# Altium project Switchberry.PrjPcb
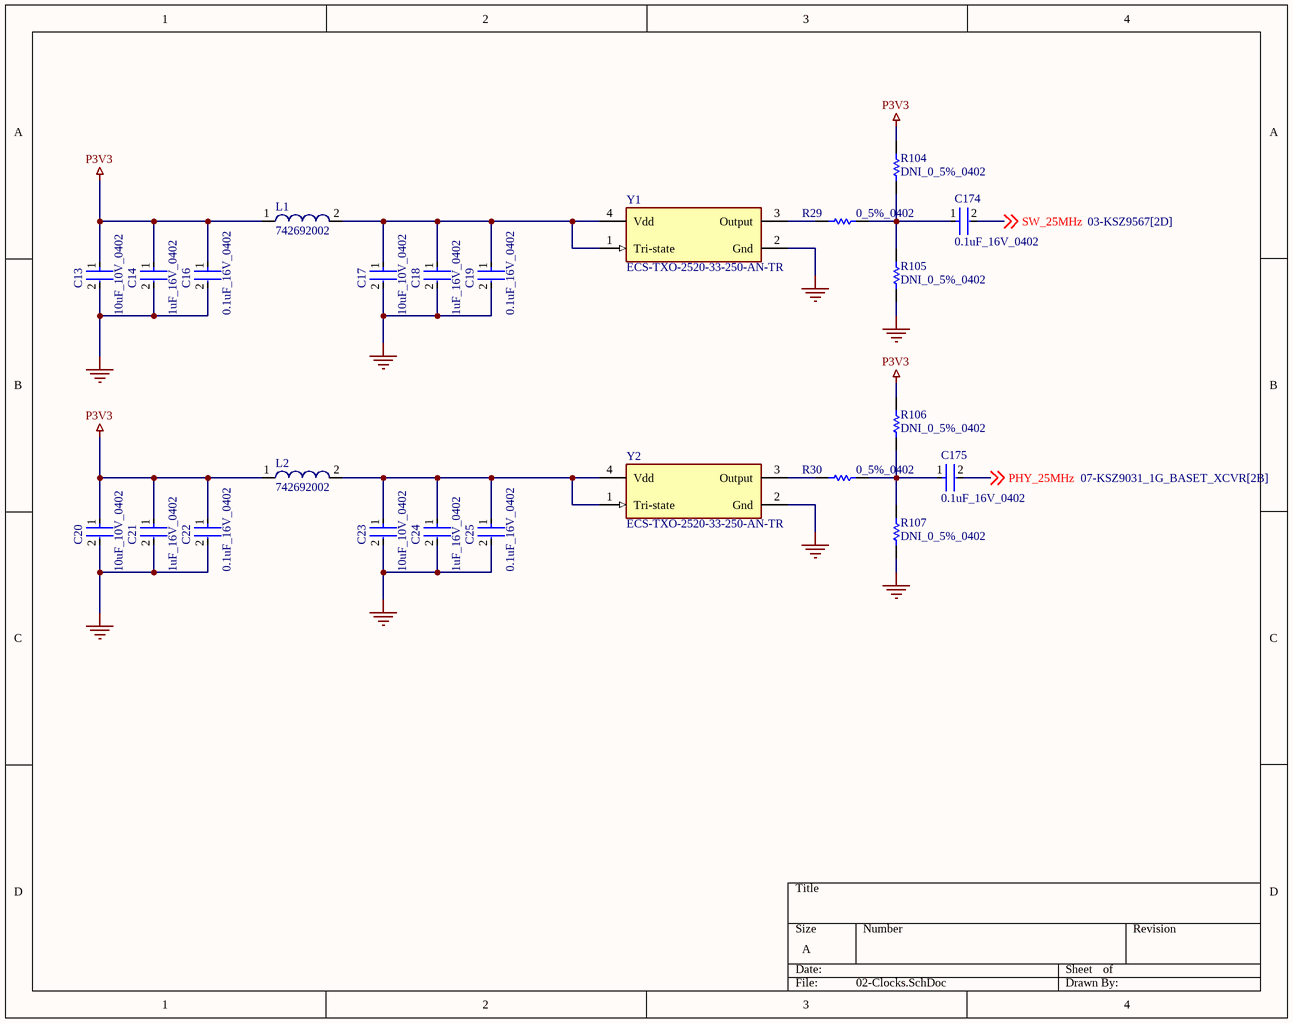
[diagram p0: 02-Clocks.SchDoc]
2 sheets, 96 parts. Net scope: global (net labels, ports and power ports of the same name join across sheets).
Board file: Switchberry.PcbDoc
Sheets:
  02-Clocks.SchDoc
  07-KSZ9031_1G_BASET_XCVR.SchDoc

## Sheet 02-Clocks.SchDoc
size A; SheetNumber: 2; SheetTotal: 11

### Parts
C13  10uF_10V_0402  [FP-CL05A106MP5NUNC-MFG]
C14  1uF_16V_0402  [FP-0402-L_1_0_0_05-W_0_5-IPC_A]
C16  0.1uF_16V_0402  [FP-C0402-BB-MFG]
C17  10uF_10V_0402  [FP-CL05A106MP5NUNC-MFG]
C18  1uF_16V_0402  [FP-0402-L_1_0_0_05-W_0_5-IPC_A]
C19  0.1uF_16V_0402  [FP-C0402-BB-MFG]
C20  10uF_10V_0402  [FP-CL05A106MP5NUNC-MFG]
C21  1uF_16V_0402  [FP-0402-L_1_0_0_05-W_0_5-IPC_A]
C22  0.1uF_16V_0402  [FP-C0402-BB-MFG]
C23  10uF_10V_0402  [FP-CL05A106MP5NUNC-MFG]
C24  1uF_16V_0402  [FP-0402-L_1_0_0_05-W_0_5-IPC_A]
C25  0.1uF_16V_0402  [FP-C0402-BB-MFG]
C174  0.1uF_16V_0402  [FP-C0402-BB-MFG]
C175  0.1uF_16V_0402  [FP-C0402-BB-MFG]
L1  742692002  [WE-TMSB 0201]
L2  742692002  [WE-TMSB 0201]
R29  0_5%_0402  [RESC1005X40X25NL05T10]
R30  0_5%_0402  [RESC1005X40X25NL05T10]
R104  DNI_0_5%_0402  [RESC1005X40X25NL05T10]  (no BOM)
R105  DNI_0_5%_0402  [RESC1005X40X25NL05T10]  (no BOM)
R106  DNI_0_5%_0402  [RESC1005X40X25NL05T10]  (no BOM)
R107  DNI_0_5%_0402  [RESC1005X40X25NL05T10]  (no BOM)
Y1  ECS-TXO-2520-33-250-AN-TR  [FP-ECS-TXO-2520-MFG]
Y2  ECS-TXO-2520-33-250-AN-TR  [FP-ECS-TXO-2520-MFG]

### Nets
GND: C13.2 C14.2 C16.2 C17.2 C18.2 C19.2 C20.2 C21.2 C22.2 C23.2 C24.2 C25.2 R105.1 R107.1 Y1.2(Gnd) Y2.2(Gnd)
P3V3: C13.1 C14.1 C16.1 C20.1 C21.1 C22.1 L1.1 L2.1 R104.2 R106.2
PHY_25MHz: C175.2 ; off-sheet PHY_25MHz
SW_25MHz: C174.2 ; off-sheet SW_25MHz
NetC17_1: C17.1 C18.1 C19.1 L1.2 Y1.1(Tri-state) Y1.4(Vdd)
NetC23_1: C23.1 C24.1 C25.1 L2.2 Y2.1(Tri-state) Y2.4(Vdd)
NetC174_1: C174.1 R29.2 R104.1 R105.2
NetC175_1: C175.1 R30.2 R106.1 R107.2
NetR29_1: R29.1 Y1.3(Output)
NetR30_1: R30.1 Y2.3(Output)

### Library data of the parts
C13 C17 C20 C23 = CMP-13271-000002-1: CAP CER 10UF 10V X5R 0402; Manufacturer Part Number: CL05A106MP5NUNC; Manufacturer: Samsung; Temperature Coefficient: 15%; Tolerance: 20%; Material: Ceramic; Octopart: https://octopart.com/cl05a106mp5nunc-samsung-22457395; Voltage Rating: 10V; RoHS: TRUE; Value: 10uF; Height: 0.7mm; Digikey Description: CAP CER 10UF 10V X5R 0402; Automotive: No; Package: CL05A106MP5NUNC; Device Class L1: Passive Components; Capacitance: 10uF; Temperature Range High: +85°C; ComponentLink2Description: Datasheet; Device Class L2: Capacitors; Temperature Characteristic: X5R; Temperature: -55°C to +85°C; ComponentLink2URL: http://www.samsungsem.com/kr/support/product-search/mlcc/__icsFiles/afieldfile/2019/05/10/19-CL05A106MP5NUNC.pdf; Device Class L3: Ceramic Capacitors; Category: Cap; Temperature Range Low: -55°C; Ipc Land Pattern Name: CAPC10050X50; Lead Free: Yes
C14 C18 C21 C24 = CMP-14477-000104-2: None; Tolerance: 10%; Voltage Rating: 16V; Dielectric: X5R; Capacitance: 1uF; Packaging: Tape and Reel; Depth: 0.5mm; Mount: Surface Mount; Thickness: 0.022inch; Package Quantity: 1; Min Operating Temperature: -55°C; Series: M; Voltage Rating (DC): 16V; Termination: SMD/SMT; Case/Package: 0402; Number of Pins: 2; Case Code (Imperial): 0402; Length: 1mm; Halogen Free: Halogen Free; Case Code (Metric): 1005; Width: 0.02inch; RoHS Compliant: Yes; Radiation Hardening: No; Max Operating Temperature: 85°C; Height: 0.5mm; Construction: Flat
C16 C19 C22 C25 C174 C175 = CMP-1034-02068-3: CAP CER 0.1UF 16V 5% X7R 0402; Manufacturer: Kemet; Manufacturer Part Number: C0402C104J4RACTU; Value: 0.10 μF; Temperature Coefficient: 15%; Tolerance: 0.05; Material: Ceramic; ComponentLink2URL: https://content.kemet.com/datasheets/KEM_C1002_X7R_SMD.pdf; Automotive: No; Device Class L2: Capacitors; Temperature: -55°C to +125°C; RoHS: TRUE; Voltage Rating: 16 V; ComponentLink2Description: Datasheet; Device Class L3: Ceramic Capacitors; Temperature Range Low: -55°C; Ipc Land Pattern Name: CAPC10050X50; Device Class L1: Passive Components; Temperature Range High: +125°C; Package: C0402-BB; Capacitance: 0.10 μF; Category: Cap; Mouser Description: CAP CER 0.1UF 16V X7R 0402; Height: 0.55mm; Digikey Description: CAP CER 0.1UF 16V 5% X7R 0402; Octopart: https://octopart.com/c0402c104j4ractu-kemet-12573893; Temperature Characteristic: X7R; Lead Free: Yes
L1 L2 = CMP-1490-00001-1: Tiny Multilayer Suppression  Bead  WE-TMSB, Z= 60 Ohm; Manufacturer: Wuerth Elektronik; Impedance: 60 Ohm; PartNumber: 742692002; PackageReference: WE-TMSB 0201; ComponentLink1Description: Manufacturer URL; ComponentLink2URL: http://www.we-online.de/katalog/media/pdf/742692002.pdf; ComponentLink1URL: http://www.we-online.com; ComponentLink2Description: Datasheet
R29 R30 R104-R107 = CMP-2002-06457-1: Manufacturer: Panasonic; Part Number: ERJ-U020R00X
Y1 Y2 = CMP-40224-000034-1: XTAL OSC TCXO 25.0000MHZ HCMOS; RoHS Compliant: Yes

## Sheet 07-KSZ9031_1G_BASET_XCVR.SchDoc
size B; SheetNumber: 7; SheetTotal: 11
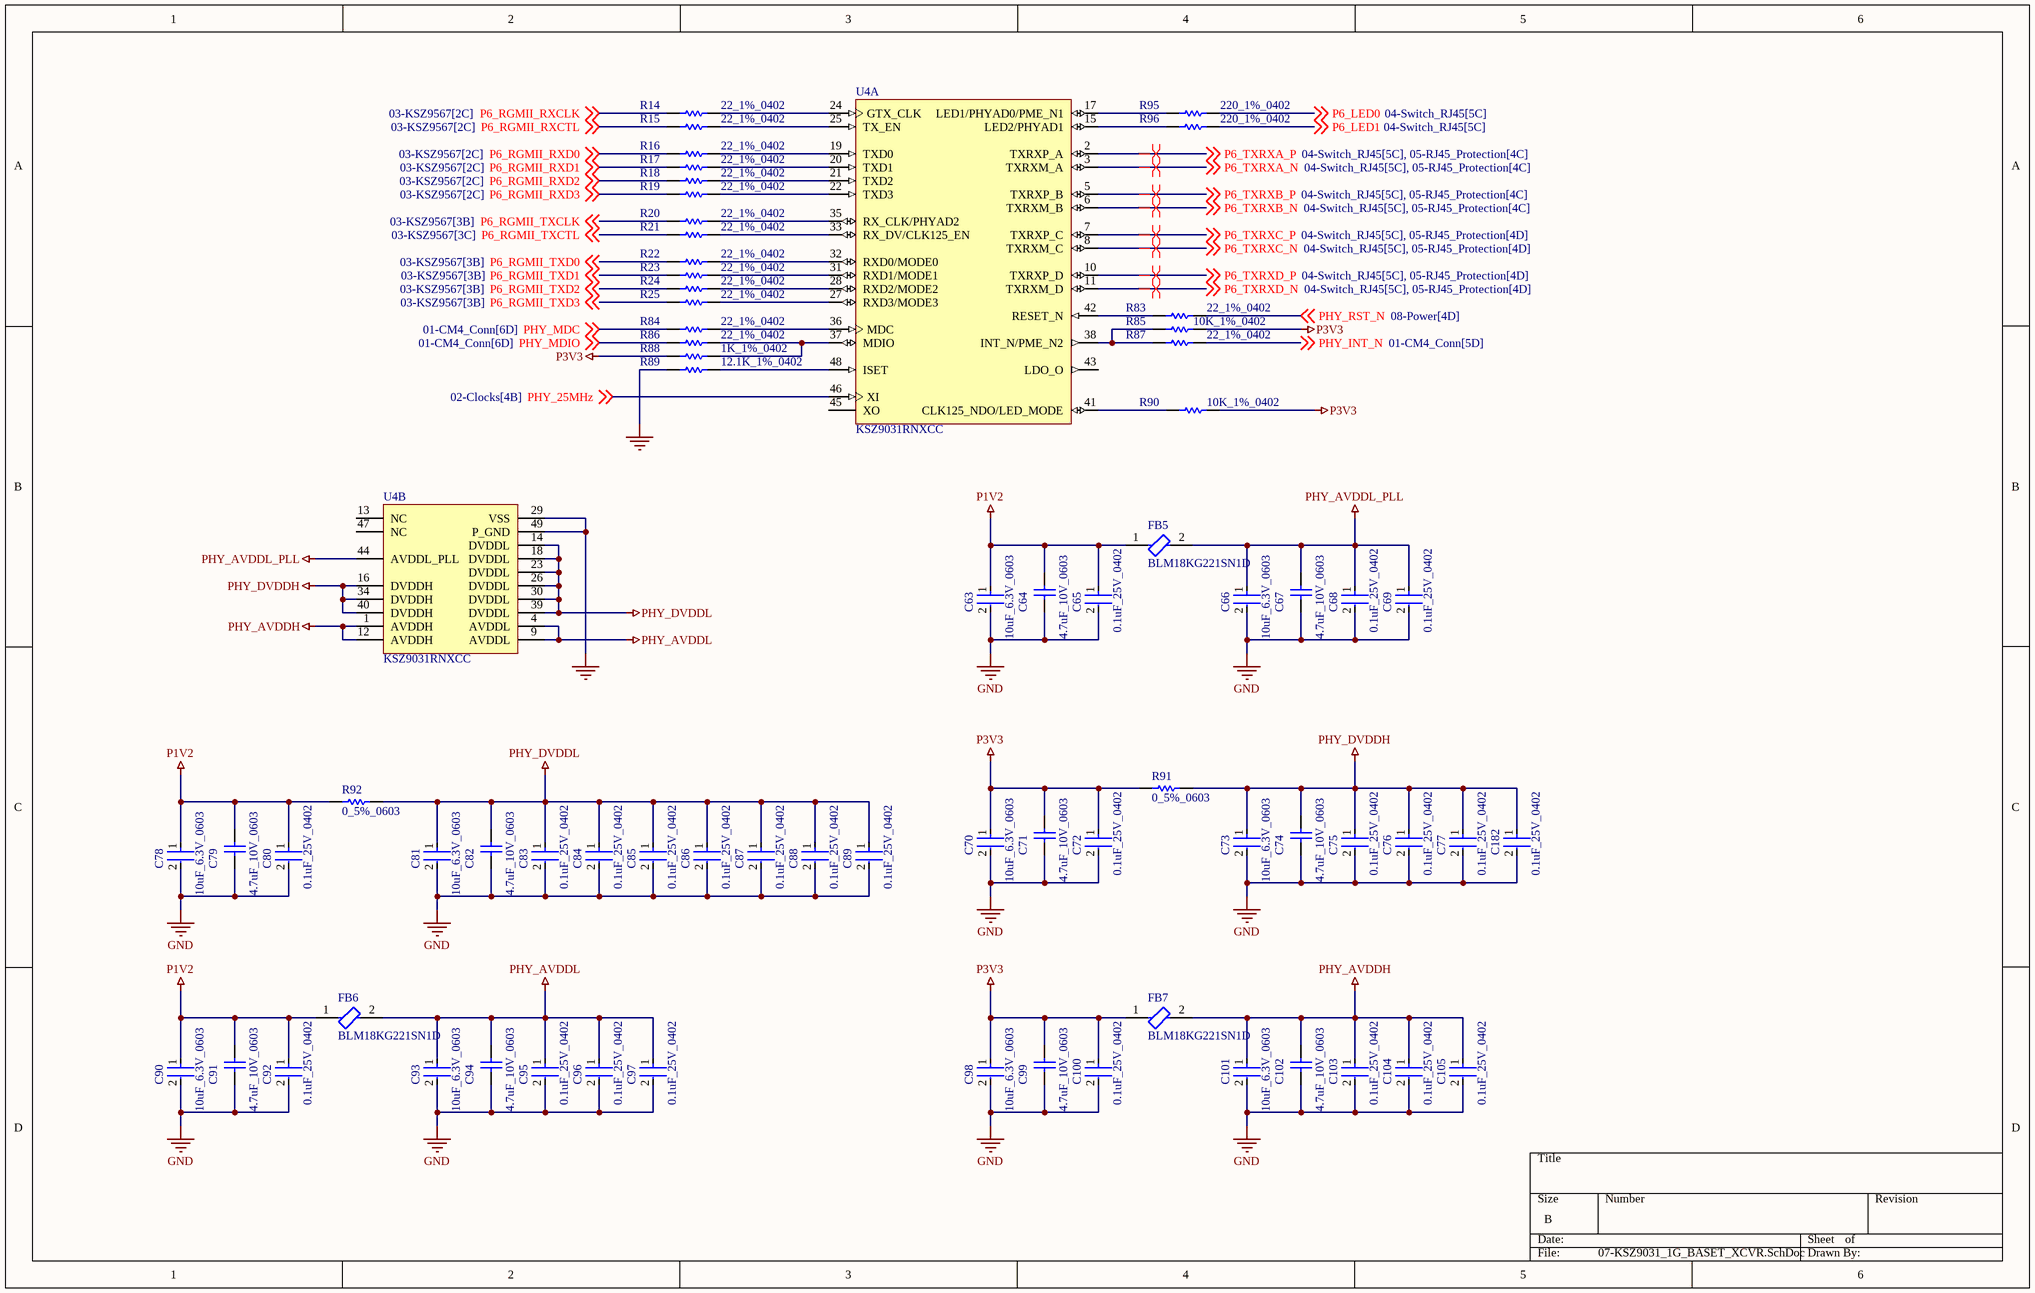
[diagram p1: 07-KSZ9031_1G_BASET_XCVR.SchDoc]

### Parts
C63  10uF_6.3V_0603  [FP-C0603C106M9PACTU-MFG]
C64  4.7uF_10V_0603  [CAPC1608X87X35NL15T15]
C65  0.1uF_25V_0402  [FP-0402-L_1_0_1-W_0_5_0_1-IPC_C]
C66  10uF_6.3V_0603  [FP-C0603C106M9PACTU-MFG]
C67  4.7uF_10V_0603  [CAPC1608X87X35NL15T15]
C68  0.1uF_25V_0402  [FP-0402-L_1_0_1-W_0_5_0_1-IPC_C]
C69  0.1uF_25V_0402  [FP-0402-L_1_0_1-W_0_5_0_1-IPC_C]
C70  10uF_6.3V_0603  [FP-C0603C106M9PACTU-MFG]
C71  4.7uF_10V_0603  [CAPC1608X87X35NL15T15]
C72  0.1uF_25V_0402  [FP-0402-L_1_0_1-W_0_5_0_1-IPC_C]
C73  10uF_6.3V_0603  [FP-C0603C106M9PACTU-MFG]
C74  4.7uF_10V_0603  [CAPC1608X87X35NL15T15]
C75  0.1uF_25V_0402  [FP-0402-L_1_0_1-W_0_5_0_1-IPC_C]
C76  0.1uF_25V_0402  [FP-0402-L_1_0_1-W_0_5_0_1-IPC_C]
C77  0.1uF_25V_0402  [FP-0402-L_1_0_1-W_0_5_0_1-IPC_C]
C78  10uF_6.3V_0603  [FP-C0603C106M9PACTU-MFG]
C79  4.7uF_10V_0603  [CAPC1608X87X35NL15T15]
C80  0.1uF_25V_0402  [FP-0402-L_1_0_1-W_0_5_0_1-IPC_C]
C81  10uF_6.3V_0603  [FP-C0603C106M9PACTU-MFG]
C82  4.7uF_10V_0603  [CAPC1608X87X35NL15T15]
C83  0.1uF_25V_0402  [FP-0402-L_1_0_1-W_0_5_0_1-IPC_C]
C84  0.1uF_25V_0402  [FP-0402-L_1_0_1-W_0_5_0_1-IPC_C]
C85  0.1uF_25V_0402  [FP-0402-L_1_0_1-W_0_5_0_1-IPC_C]
C86  0.1uF_25V_0402  [FP-0402-L_1_0_1-W_0_5_0_1-IPC_C]
C87  0.1uF_25V_0402  [FP-0402-L_1_0_1-W_0_5_0_1-IPC_C]
C88  0.1uF_25V_0402  [FP-0402-L_1_0_1-W_0_5_0_1-IPC_C]
C89  0.1uF_25V_0402  [FP-0402-L_1_0_1-W_0_5_0_1-IPC_C]
C90  10uF_6.3V_0603  [FP-C0603C106M9PACTU-MFG]
C91  4.7uF_10V_0603  [CAPC1608X87X35NL15T15]
C92  0.1uF_25V_0402  [FP-0402-L_1_0_1-W_0_5_0_1-IPC_C]
C93  10uF_6.3V_0603  [FP-C0603C106M9PACTU-MFG]
C94  4.7uF_10V_0603  [CAPC1608X87X35NL15T15]
C95  0.1uF_25V_0402  [FP-0402-L_1_0_1-W_0_5_0_1-IPC_C]
C96  0.1uF_25V_0402  [FP-0402-L_1_0_1-W_0_5_0_1-IPC_C]
C97  0.1uF_25V_0402  [FP-0402-L_1_0_1-W_0_5_0_1-IPC_C]
C98  10uF_6.3V_0603  [FP-C0603C106M9PACTU-MFG]
C99  4.7uF_10V_0603  [CAPC1608X87X35NL15T15]
C100  0.1uF_25V_0402  [FP-0402-L_1_0_1-W_0_5_0_1-IPC_C]
C101  10uF_6.3V_0603  [FP-C0603C106M9PACTU-MFG]
C102  4.7uF_10V_0603  [CAPC1608X87X35NL15T15]
C103  0.1uF_25V_0402  [FP-0402-L_1_0_1-W_0_5_0_1-IPC_C]
C104  0.1uF_25V_0402  [FP-0402-L_1_0_1-W_0_5_0_1-IPC_C]
C105  0.1uF_25V_0402  [FP-0402-L_1_0_1-W_0_5_0_1-IPC_C]
C182  0.1uF_25V_0402  [FP-0402-L_1_0_1-W_0_5_0_1-IPC_C]
FB5  BLM18KG221SN1D  [FP-BLM18-0_15-t0_8-IPC_B]
FB6  BLM18KG221SN1D  [FP-BLM18-0_15-t0_8-IPC_B]
FB7  BLM18KG221SN1D  [FP-BLM18-0_15-t0_8-IPC_B]
R14  22_1%_0402  [RESC1005X40X25ML05T10]
R15  22_1%_0402  [RESC1005X40X25ML05T10]
R16  22_1%_0402  [RESC1005X40X25ML05T10]
R17  22_1%_0402  [RESC1005X40X25ML05T10]
R18  22_1%_0402  [RESC1005X40X25ML05T10]
R19  22_1%_0402  [RESC1005X40X25ML05T10]
R20  22_1%_0402  [RESC1005X40X25ML05T10]
R21  22_1%_0402  [RESC1005X40X25ML05T10]
R22  22_1%_0402  [RESC1005X40X25ML05T10]
R23  22_1%_0402  [RESC1005X40X25ML05T10]
R24  22_1%_0402  [RESC1005X40X25ML05T10]
R25  22_1%_0402  [RESC1005X40X25ML05T10]
R83  22_1%_0402  [RESC1005X40X25ML05T10]
R84  22_1%_0402  [RESC1005X40X25ML05T10]
R85  10K_1%_0402  [RESC1005X40X25NL10T10]
R86  22_1%_0402  [RESC1005X40X25ML05T10]
R87  22_1%_0402  [RESC1005X40X25ML05T10]
R88  1K_1%_0402  [RESC1005X40X25ML05T10]
R89  12.1K_1%_0402  [RESC1005X40X25NL10T10]
R90  10K_1%_0402  [RESC1005X40X25NL10T10]
R91  0_5%_0603  [RESC1608X55X25ML10T15]
R92  0_5%_0603  [RESC1608X55X25ML10T15]
R95  220_1%_0402  [RESC1005X40X25NL05T10]
R96  220_1%_0402  [RESC1005X40X25NL05T10]
U4  KSZ9031RNXCC  [MICL-QFN-48_V]  (parts A,B of 2)

### Nets
GND: C63.2 C64.1 C65.2 C66.2 C67.1 C68.2 C69.2 C70.2 C71.1 C72.2 C73.2 C74.1 C75.2 C76.2 C77.2 C78.2 C79.1 C80.2 C81.2 C82.1 C83.2 C84.2 C85.2 C86.2 C87.2 C88.2 C89.2 C90.2 C91.1 C92.2 C93.2 C94.1 C95.2 C96.2 C97.2 C98.2 C99.1 C100.2 C101.2 C102.1 C103.2 C104.2 C105.2 C182.2 R89.1 U4.29(VSS) U4.49(P_GND)
P1V2: C63.1 C64.2 C65.1 C78.1 C79.2 C80.1 C90.1 C91.2 C92.1 FB5.1 FB6.1 R92.1
P3V3: C70.1 C71.2 C72.1 C98.1 C99.2 C100.1 FB7.1 R85.2 R88.1 R90.2 R91.1
PHY_AVDDH: C101.1 C102.2 C103.1 C104.1 C105.1 FB7.2 U4.1(AVDDH) U4.12(AVDDH)
PHY_AVDDL: C93.1 C94.2 C95.1 C96.1 C97.1 FB6.2 U4.4(AVDDL) U4.9(AVDDL)
PHY_AVDDL_PLL: C66.1 C67.2 C68.1 C69.1 FB5.2 U4.44(AVDDL_PLL)
PHY_DVDDH: C73.1 C74.2 C75.1 C76.1 C77.1 C182.1 R91.2 U4.16(DVDDH) U4.34(DVDDH) U4.40(DVDDH)
PHY_DVDDL: C81.1 C82.2 C83.1 C84.1 C85.1 C86.1 C87.1 C88.1 C89.1 R92.2 U4.14(DVDDL) U4.18(DVDDL) U4.23(DVDDL) U4.26(DVDDL) U4.30(DVDDL) U4.39(DVDDL)
P6_LED0: R95.2 ; off-sheet P6_LED0
P6_LED1: R96.2 ; off-sheet P6_LED1
P6_RGMII_RXCLK: R14.1 ; off-sheet P6_RGMII_RXCLK
P6_RGMII_RXCTL: R15.1 ; off-sheet P6_RGMII_RXCTL
P6_RGMII_RXD0: R16.1 ; off-sheet P6_RGMII_RXD0
P6_RGMII_RXD1: R17.1 ; off-sheet P6_RGMII_RXD1
P6_RGMII_RXD2: R18.1 ; off-sheet P6_RGMII_RXD2
P6_RGMII_RXD3: R19.1 ; off-sheet P6_RGMII_RXD3
P6_RGMII_TXCLK: R20.1 ; off-sheet P6_RGMII_TXCLK
P6_RGMII_TXCTL: R21.1 ; off-sheet P6_RGMII_TXCTL
P6_RGMII_TXD0: R22.1 ; off-sheet P6_RGMII_TXD0
P6_RGMII_TXD1: R23.1 ; off-sheet P6_RGMII_TXD1
P6_RGMII_TXD2: R24.1 ; off-sheet P6_RGMII_TXD2
P6_RGMII_TXD3: R25.1 ; off-sheet P6_RGMII_TXD3
P6_TXRXA_N: U4.3(TXRXM_A) ; off-sheet P6_TXRXA_N
P6_TXRXA_P: U4.2(TXRXP_A) ; off-sheet P6_TXRXA_P
P6_TXRXB_N: U4.6(TXRXM_B) ; off-sheet P6_TXRXB_N
P6_TXRXB_P: U4.5(TXRXP_B) ; off-sheet P6_TXRXB_P
P6_TXRXC_N: U4.8(TXRXM_C) ; off-sheet P6_TXRXC_N
P6_TXRXC_P: U4.7(TXRXP_C) ; off-sheet P6_TXRXC_P
P6_TXRXD_N: U4.11(TXRXM_D) ; off-sheet P6_TXRXD_N
P6_TXRXD_P: U4.10(TXRXP_D) ; off-sheet P6_TXRXD_P
PHY_25MHz: U4.46(XI) ; off-sheet PHY_25MHz
PHY_INT_N: R87.2 ; off-sheet PHY_INT_N
PHY_MDC: R84.1 ; off-sheet PHY_MDC
PHY_MDIO: R86.1 ; off-sheet PHY_MDIO
PHY_RST_N: R83.2 ; off-sheet PHY_RST_N
NetR14_2: R14.2 U4.24(GTX_CLK)
NetR15_2: R15.2 U4.25(TX_EN)
NetR16_2: R16.2 U4.19(TXD0)
NetR17_2: R17.2 U4.20(TXD1)
NetR18_2: R18.2 U4.21(TXD2)
NetR19_2: R19.2 U4.22(TXD3)
NetR20_2: R20.2 U4.35(RX_CLK/PHYAD2)
NetR21_2: R21.2 U4.33(RX_DV/CLK125_EN)
NetR22_2: R22.2 U4.32(RXD0/MODE0)
NetR23_2: R23.2 U4.31(RXD1/MODE1)
NetR24_2: R24.2 U4.28(RXD2/MODE2)
NetR25_2: R25.2 U4.27(RXD3/MODE3)
NetR83_1: R83.1 U4.42(RESET_N)
NetR84_2: R84.2 U4.36(MDC)
NetR85_1: R85.1 R87.1 U4.38(INT_N/PME_N2)
NetR86_2: R86.2 R88.2 U4.37(MDIO)
NetR89_2: R89.2 U4.48(ISET)
NetR90_1: R90.1 U4.41(CLK125_NDO/LED_MODE)
NetR95_1: R95.1 U4.17(LED1/PHYAD0/PME_N1)
NetR96_1: R96.1 U4.15(LED2/PHYAD1)

Not connected (* = marked no-connect by the designer): U4 13(NC) 43(LDO_O) 45(XO) 47(NC)

### Layout directives
differential pair: P6_TXRXA_N, P6_TXRXA_P, P6_TXRXB_N, P6_TXRXB_P, P6_TXRXC_N, P6_TXRXC_P, P6_TXRXD_N, P6_TXRXD_P

### Library data of the parts
C63 C66 C70 C73 C78 C81 C90 C93 C98 C101 = CMP-2006-02285-3: CAP CER 10UF 6.3V X5R 0603; Manufacturer Part Number: C0603C106M9PACTU; Manufacturer: Kemet; Material: Ceramic; Temperature Coefficient: 15%; Tolerance: 20%; Category: Cap; Height: 0.9mm; Digikey Description: CAP CER 10UF 6.3V X5R 0603; Mouser Description: In a Pack of 10, KEMET 0603 (1608M) 10µF MLCC 6.3V dc ±20% SMD C0603C106M9PACTU; Voltage Rating: 6.3V; Device Class L2: Capacitors; Temperature Range Low: -55°C; Temperature Characteristic: X5R; ComponentLink2Description: Datasheet; Ipc Land Pattern Name: CAPC16080X80; ComponentLink2URL: http://www.kemet.com/Lists/ProductCatalog/Attachments/19/KEM_C1006_X5R_SMD.pdf; Capacitance: 10uF; Temperature Range High: +85°C; Device Class L3: Ceramic Capacitors; RoHS: TRUE; Automotive: No; Value: 10uF; Temperature: -55°C to +85°C; Device Class L1: Passive Components; Package: C0603C106M9PACTU; Lead Free: Yes; Octopart: https://octopart.com/c0603c106m9pactu-kemet-8375727
C64 C67 C71 C74 C79 C82 C91 C94 C99 C102 = CMP-2006-03238-1: Part Number: C0603C475K8PACTU; Manufacturer: Kemet
C65 C68 C69 C72 C75-C77 C80 C83-C89 C92 C95-C97 C100 C103-C105 C182 = CMP-2008-02519-2: General Purpose Ceramic Capacitor, 0402, 100nF, 10%, X7R, 15%, 25V; Package Quantity: 1; Capacitance: 100nF; Min Operating Temperature: -55°C; Voltage: 25V; Voltage Rating: 25V; Construction: Flat; Max Operating Temperature: 125°C; Radiation Hardening: No; Depth: 0.5mm; Thickness: 0.022inch; Voltage Rating (DC): 25V; Number of Pins: 2; Lead Free: Lead Free; Series: -; REACH SVHC: No SVHC; Length: 1mm; Dielectric: X7R; RoHS Compliant: Yes; Mount: Surface Mount; Packaging: Tape and Reel; Case/Package: 0402; Case Code (Imperial): 0402; Termination: SMD/SMT; Width: 0.02inch; Case Code (Metric): 1005; Tolerance: 10%
FB5-FB7 = CMP-0686-00556-7: Chip Ferrite Bead, 0603, 220Ω @ 100MHz, 0.05Ω, 25%, 2.2A; DC Resistance (DCR): 50mR; Number of Circuits: 1; Impedance: 220R; Current Rating: 2.2A; Material: Ferrite; Test Frequency: 100MHz; Depth: 0.8mm; Series: BLM18K; RoHS Compliant: Yes; Termination: SMD/SMT; Max Current Rating: 2.2A; Case Code (Metric): 1608; Radiation Hardening: No; Number of Pins: 2; Length: 1.6mm; Lead Free: Lead Free; Package Quantity: 1; Height: 0.8mm; Core Material: Ferrite; Inductor Type: FERRITE BEAD; Min Operating Temperature: -55°C; Case/Package: 0603; Case Code (Imperial): 0603; Number of Lines: 1; Packaging: Tape and Reel; REACH SVHC: No SVHC; Max Operating Temperature: 125°C; Military Standard: Not; DC Resistance-Max: 50mR; Width: 0.8mm; DC Current: 2.2A; Max DC Current: 2.2A; Tolerance: 25%; Weight: 7.1E-05oz
R14-R25 R83 R84 R86 R87 = CMP-2002-07182-1: Part Number: RC0402FR-1322RL; Manufacturer: Yageo / Phycomp
R85 R90 = CMP-2002-04694-1: Manufacturer: Bourns; Part Number: CR0402-FX-1002GLF
R88 = CMP-2002-06478-1: Manufacturer: Multicomp; Part Number: MCMR04X1001FTL
R89 = CMP-2002-05926-1: Manufacturer: Multicomp; Part Number: MC00625W0402112K1
R91 R92 = CMP-2100-03667-1: Chip Resistor, 0 Ohm, +/- 5%, 0.1 W, -55 to 155 degC, 0603 (1608 Metric), RoHS, Tape and Reel; Manufacturer: Yageo; Temperature Coefficient: 200ppm/degreesC; Voltage Rating: 50V; Power Rating: 100mW; Resistance: 0mOhm; Width: 0.8mm; Max Operating Temperature: 155degC; Tolerance: 5%; Package Reference: 0603; Height: 0.45mm; Depth: 0.8mm; Package Description: 2-Pin Surface Mount Device, Body 1.6 x 0.8 mm; Termination: SMD/SMT; Package Quantity: 5000; Case/Package: 0603; Case Code (Imperial): 0603; Radiation Hardening: No; Number of Pins: 2; Length: 1.6mm; Lead Free: LeadFree; Voltage Rating (DC): 50V; Military Standard: Not; Datasheet URL: http://www.yageo.com/NewPortal/yageodocoutput?fileName=/pdf/R-Chip/PYu-RC_Group_51_RoHS_L_5.pdf; Manufacturer URL: http://www.yageo.com/; Packaging: TapeandReel; Case Code (Metric): 1608; Min Operating Temperature: -55degC; Composition: ThickFilm; RoHSCompliant: true; Contact Plating: Tin; Datasheet Version: Rev. 5, 10/2016; REACH SVHC: NoSVHC
R95 R96 = CMP-2002-07959-1: Manufacturer: Yageo / Phycomp; Part Number: RC0402JR-07220RL
U4 = CMP-1337-00003-2: Gigabit Ethernet Transceiver with RGMII Support, 1.14 to 1.26 V, 0 to 70 degC, 48-Pin QFN, RoHS; Manufacturer: Micrel; Output Tri-State Leakage: 10 uA Max.; ILED: 8 mA Typ.; Receivers: 4; VSET@R(ISET): 12.1 KOhm=1.2 V Typ.; DatasheetVersion: Rev. 2.1; PackageDescription: 48-Pin Quad Flat Non-Lead Package, Body 7 x 7 mm, Pitch 0.5 mm; RoHS: TRUE; DVDDL: 1.14 to 1.26 V; ComponentLink1URL: http://www.micrel.com/; PartNumber: KSZ9031RNXCC; Temperature Range: 0 to 70 degC; ComponentLink1Description: Manufacturer URL; ComponentLink3Description: Package Specification; Mounting Technology: Surface Mount; ComponentLink2Description: Datasheet; Drivers: 4; ComponentLink2URL: http://www.micrel.com/_PDF/Ethernet/datasheets/KSZ9031RNX.pdf; ComponentLink3URL: http://www.micrel.com/_PDF/Ethernet/datasheets/KSZ9031RNX.pdf

## Nets that join several sheets
GND: 02-Clocks (16 pins), 07-KSZ9031_1G_BASET_XCVR (47 pins)
P3V3: 02-Clocks (10 pins), 07-KSZ9031_1G_BASET_XCVR (11 pins)
PHY_25MHz: 02-Clocks (C175.2), 07-KSZ9031_1G_BASET_XCVR (U4.46)